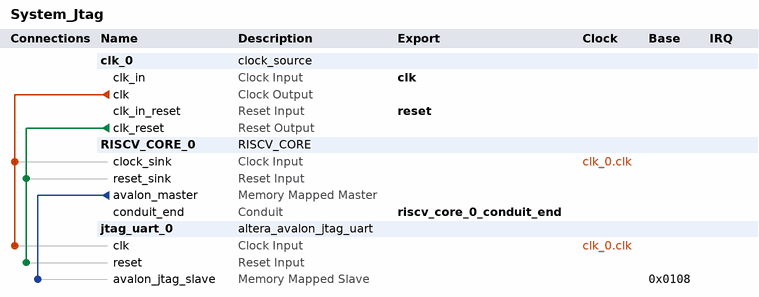
[diagram p0: system contents]
# Platform Designer (Qsys) system System_Jtag, Cyclone II EP2C20F484C7
# Parameters at their usual value, and those the tool derives, are not listed.
package require -exact qsys 13.0
create_system System_Jtag
set_project_property DEVICE_FAMILY {Cyclone II}
set_project_property DEVICE EP2C20F484C7

add_instance clk_0 clock_source 13.0
set_instance_parameter_value clk_0 clockFrequency 50000000

add_instance RISCV_CORE_0 RISCV_CORE 1.0
set_instance_parameter_value RISCV_CORE_0 DATA_W 32
set_instance_parameter_value RISCV_CORE_0 ALU_SEL_W 4
set_instance_parameter_value RISCV_CORE_0 ADDR_W 5
set_instance_parameter_value RISCV_CORE_0 DMEM_ADDR_W 12
set_instance_parameter_value RISCV_CORE_0 INST_W 32
set_instance_parameter_value RISCV_CORE_0 ADDR_W_IMEM 12
set_instance_parameter_value RISCV_CORE_0 CONTROL_WORD_W 22

add_instance jtag_uart_0 altera_avalon_jtag_uart 13.0.1.99.2
set_instance_parameter_value jtag_uart_0 simInteractiveOptions NO_INTERACTIVE_WINDOWS
set_instance_parameter_value jtag_uart_0 writeBufferDepth 1024

# connections
add_connection clk_0.clk jtag_uart_0.clk clock
add_connection clk_0.clk RISCV_CORE_0.clock_sink clock
add_connection clk_0.clk_reset jtag_uart_0.reset reset
add_connection clk_0.clk_reset RISCV_CORE_0.reset_sink reset
add_connection RISCV_CORE_0.avalon_master jtag_uart_0.avalon_jtag_slave avalon
set_connection_parameter_value RISCV_CORE_0.avalon_master/jtag_uart_0.avalon_jtag_slave baseAddress 0x0108

# exported interfaces
add_interface clk clock sink
set_interface_property clk EXPORT_OF clk_0.clk_in
add_interface reset reset sink
set_interface_property reset EXPORT_OF clk_0.clk_in_reset
add_interface riscv_core_0_conduit_end conduit end
set_interface_property riscv_core_0_conduit_end EXPORT_OF RISCV_CORE_0.conduit_end

set_interconnect_requirement {$system} qsys_mm.clockCrossingAdapter HANDSHAKE
set_interconnect_requirement {$system} qsys_mm.maxAdditionalLatency 1

save_system System_Jtag.qsys
